# EAGLE design Chronio REV3 (EAGLE 7.7.0)
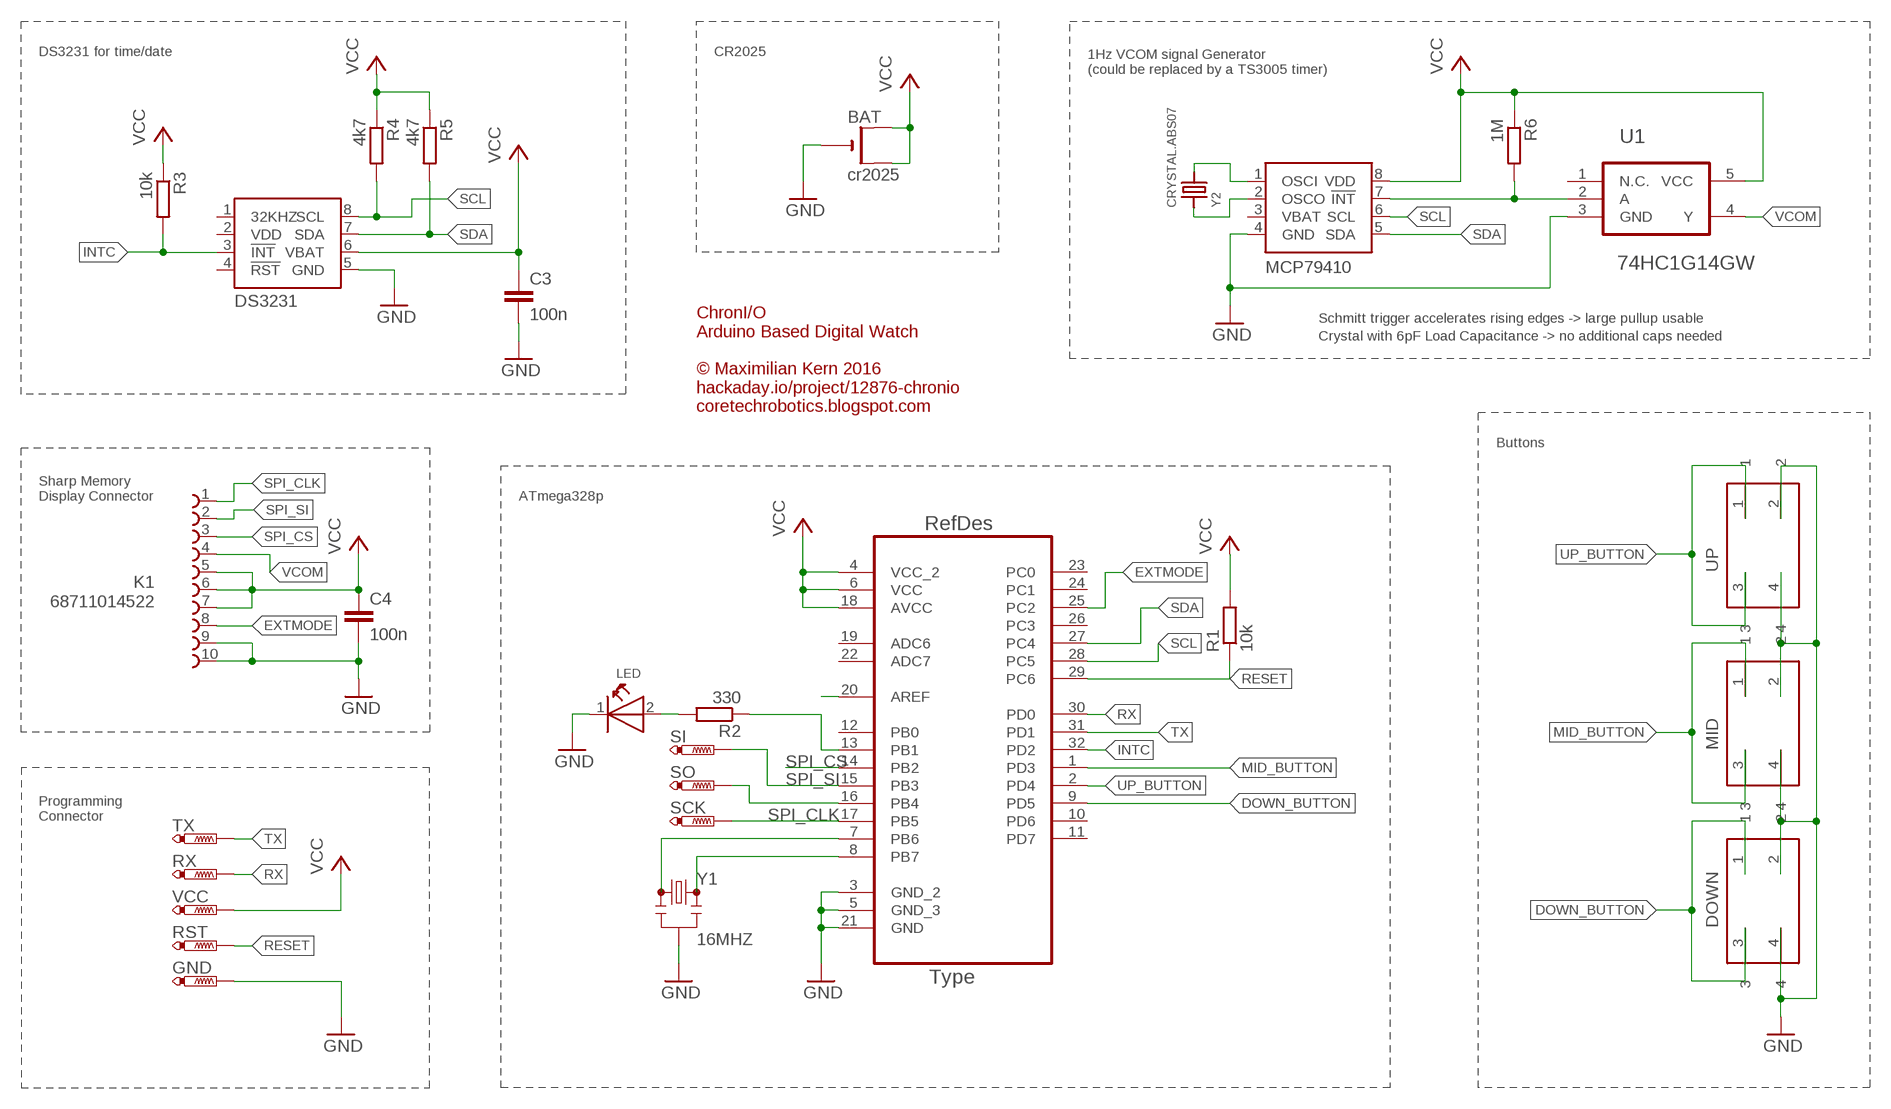
[diagram p0: schematic, sheet 1]

## Parts
ATMEGA328P  ATMEGA328P-AU  [QFP80P900X900X120-32N]
BAT  cr2025  CR2032SMT  [CR2032-SMD]
C3  100n  C-EUC0805  [C0805]
C4  100n  C-EUC0805  [C0805]
DOWN  434331045822  [434331045822]
DS3231  DS3231MLMD  [SO08]
GND  PTR1TP14SQ  [TP14SQ]
K1  68711014522  [68711014522]
LED  WL-SMCW-150060GS75000-G  [0603]
MCP79410  PCF8523T/1LMD  [SO08]
MID  434331045822  [434331045822]
R1  10k  R-EU_R0805  [R0805]
R2  330  R-EU_R0805  [R0805]
R3  10k  R-EU_R0805  [R0805]
R4  4k7  R-EU_R0805  [R0805]
R5  4k7  R-EU_R0805  [R0805]
R6  1M  R-EU_R0805  [R0805]
RST  PTR1TP14SQ  [TP14SQ]
RX  PTR1TP14SQ  [TP14SQ]
SCK  PTR1TP14SQ  [TP14SQ]
SI  PTR1TP14SQ  [TP14SQ]
SO  PTR1TP14SQ  [TP14SQ]
TX  PTR1TP14SQ  [TP14SQ]
U1  74HC1G14GW  [SOT65P210X110-5N]
UP  434331045822  [434331045822]
VCC  PTR1TP14SQ  [TP14SQ]
Y1  16MHZ  RESONATOR16MHZ  [RESONATOR-SMD]
Y2  CRYSTAL.ABS07  [ABS07]

## Nets
AREF: ATMEGA328P.20(AREF)
DOWN_BUTTON: ATMEGA328P.9(PD5) DOWN.1 DOWN.3
EXTMODE: ATMEGA328P.25(PC2) K1.8
GND: ATMEGA328P.3(GND_2) ATMEGA328P.5(GND_3) ATMEGA328P.21(GND) BAT.- C3.2 C4.2 DOWN.2 DOWN.4 DS3231.5(GND) GND.TP K1.9 K1.10 LED.1(K) MCP79410.4(GND) MID.2 MID.4 U1.3(GND) UP.2 UP.4 Y1.2
INTC: ATMEGA328P.32(PD2) DS3231.3(!INT) R3.2
MID_BUTTON: ATMEGA328P.1(PD3) MID.1 MID.3
N$1: ATMEGA328P.7(PB6) Y1.1
N$2: ATMEGA328P.8(PB7) Y1.3
N$3: MCP79410.7(!INT) R6.2 U1.2(A)
N$4: ATMEGA328P.16(PB4) SO.TP
N$5: MCP79410.1(OSCI) Y2.2
N$6: ATMEGA328P.13(PB1) R2.1
N$7: LED.2(A) R2.2
N$8: MCP79410.2(OSCO) Y2.1
RESET: ATMEGA328P.29(PC6) R1.1 RST.TP
RX: ATMEGA328P.30(PD0) RX.TP
SCL: ATMEGA328P.28(PC5) DS3231.8(SCL) MCP79410.6(SCL) R4.2
SDA: ATMEGA328P.27(PC4) DS3231.7(SDA) MCP79410.5(SDA) R5.2
SPI_CLK: ATMEGA328P.17(PB5) K1.1 SCK.TP
SPI_CS: ATMEGA328P.14(PB2) K1.3
SPI_SI: ATMEGA328P.15(PB3) K1.2 SI.TP
TX: ATMEGA328P.31(PD1) TX.TP
UP_BUTTON: ATMEGA328P.2(PD4) UP.1 UP.3
VCC: ATMEGA328P.4(VCC_2) ATMEGA328P.6(VCC) ATMEGA328P.18(AVCC) BAT.+$1(+) BAT.+$2(+1) C3.1 C4.1 DS3231.6(VBAT) K1.5 K1.6 K1.7 MCP79410.8(VDD) R1.2 R3.1 R4.1 R5.1 R6.1 U1.5(VCC) VCC.TP
VCOM: K1.4 U1.4(Y)
Unconnected: ATMEGA328P.10(PD6) ATMEGA328P.11(PD7) ATMEGA328P.12(PB0) ATMEGA328P.19(ADC6) ATMEGA328P.22(ADC7) ATMEGA328P.23(PC0) ATMEGA328P.24(PC1) ATMEGA328P.26(PC3) DS3231.1(32KHZ) DS3231.4(!RST) U1.1(N.C.)

## Notes on the sheet
- DS3231 for time/date | CR2025
- 1Hz VCOM signal Generator
  (could be replaced by a TS3005 timer)
- Schmitt trigger accelerates rising edges -> large pullup usable
- Crystal with 6pF Load Capacitance -> no additional caps needed
- ChronI/O
  Arduino Based Digital Watch
  
  © Maximilian Kern 2016
  hackaday.io/project/12876-chronio
  coretechrobotics.blogspot.com
- Buttons
- Sharp Memory
  Display Connector
- ATmega328p
- Programming
  Connector

## Power pins joined to a net without a drawn wire
VBAT: MCP79410.3(VBAT)
VDD: DS3231.2(VDD)

## Library data of the parts
ATMEGA328P = Atmel-ATMEGA328P-AU:ATMEGA328P-AU; DESCRIPTION: 8-bit Microcontroller with In-System Programmable Flash; MPN: ATMEGA328P-AU; OC_FARNELL: 1715486; OC_NEWARK: 14R4631; PACKAGE: TQFP-32; SUPPLIER: Atmel
BAT = adafruit:CR2032
C3 C4 = resistor:C-EU: CAPACITOR, European symbol
DOWN MID UP = Eagle_TACT_SWITCHES_rev16d:434331045822: 3.5x4.7 mm SMD side push WS-TASU <http://katalog.we-online.de/media/images/v2/Family_WS_TUS_Normal_SMD_Side-Push_4343x10458xx_pf2.jpg> Details see: http://katalog.we-online.de/en/em/TASU_3_5X4_7_SMD_J-BEND_SIDE_PUSH <http://katalog.we-online.de/en/em/TASU_3_5X4_7_SMD_SIDE_PUSH> 2015 (C) Wurth Elektronik
DS3231 = coreLib:DS3231M: Produktübersicht The DS3231MZ+TRL is a ±5ppm, I2C real time clock (RTC) in 8 pin NSOIC package. The low cost, extremely accurate, I2C RTC device incorporates a battery input and maintains accurate timekeeping when main power to the device is interrupted. The integration of microelectromechanical systems (MEMS) resonator enhances long-term accuracy of the device and reduces the piece part count in manufacturing line. The RTC maintains seconds, minutes, hours, day, date, month and year information. The date at the end of the month is automatically adjusted for months with fewer than 31 days including corrections for leap year. The clock operates in either the 24hour or 12hour format with an AM/PM indicator. A precision temperature compensated voltage reference and comparator circuit monitors the status of VCC to detect power failures to provide a reset output and to automatically switch to backup supply when necessary. The RST pin is monitored as a pushbutton input for generating a microprocessor reset. Supply voltage range is 2.3V to 5.5V Operating temperature range from -40°C to 85°C Leap year compensation up to year 2100 Footprint and functionally compatible to DS3231 Two programmable time of day alarms 1Hz and 32.768KHz outputs Digital temp sensor with ±3°C accuracy Address and data are transferred serially through an I2C bidirectional bus Low power operation extends battery backup run time UL recognized Technical Data Sheet (890.91KB) EN <http://www.farnell.com/datasheets/2001796.pdf>
GND RST RX SCK SI SO TX VCC = testpad:PTR1: TEST PIN
K1 = Eagle_FPC_CONNECTOR_AND_FFC_CAB_rev15c:68711014522: WR-FPC 0.5mm SMT ZIF Horizontal Bottom Contact, 10 Pins=>Code : Con_FPC_ZIF_0.50_68711014522 <http://katalog.we-online.de/media/images/eican/Con_FPC_ZIF_0.50_6871xx14522_pf2.jpg> Details see: http://katalog.we-online.de/en/em/687_1xx_145_22 Created 2014-07-09, Karrer Zheng 2014 (C) Würth Elektronik
LED = Eagle_COLOR_LED_rev15c:WL-SMCW: SMD mono-color Chip LED Characteristics Low energy consumption High reliability Low current requirement Fast switching No UV/IR radiation Smallest SMD package with exceptional brightness Top view Wide viewing angle PBC high-usage Applications Backlight for mobile and portable device keypads Indoor and outdoor message boards Flat backlight for LCDs, switches and symbols Display for industrial control systems and traffic Miniaturized color effects Pedestrian mark Optical indicators General lighting Toys <http://katalog.we-online.de/media/images/eipal/WL-SMCW_pf2.jpg> Details see: http://katalog.we-online.de/en/led/WL-SMCW?m Updated 2015-04-10 2015 (C) Wurth Elektronik; COMPANY-URL: http://www.we-online.de; CREATED-BY: Christin Otto; CREATED-DATE: APR 2013; DATASHEET-URL: http://katalog.we-online.de/en/led/WL-SMCW?m=t&sq=smcw&sp=&sp=http%3A%2F%2Fwww.we-online.de%2Fweb%2Fen%2Felectronic_components%2Fsearchpage_PBS.php%3Fsearch%3Dsmcw#vs_t2:2; MANUFACTURER: Würth Elektronik eiSos GmbH
MCP79410 = PCF8523:PCF8523T/1: Produktübersicht The PCF8523T/1,118 is a Real-Time Clock and calendar optimized for low power consumption. Data is transferred serially via the I²C-bus with a maximum data rate of 1000kbps. Alarm and timer functions are available with the possibility to generate a wake-up signal on an interrupt pin. An offset register allows fine-tuning of the clock. This has a backup battery switch-over circuit, which detects power failures and automatically switches to the battery supply when a power failure occurs. Battery backup input pin and switch-over circuit Freely programmable timer and alarm with interrupt capability Internal power-on reset Open-drain interrupt or clock output pins Programmable offset register for frequency adjustment Technical Data Sheet (631.73KB) EN <http://www.farnell.com/datasheets/1923815.pdf>
R1-R6 = resistor:R-EU_: RESISTOR, European symbol
U1 = 74HC1G14GW:74HC1G14GW: Inverter; MPN: 74HC1G14GW; OC_FARNELL: 1085254; OC_NEWARK: 03P2771; PACKAGE: SOT-5; SUPPLIER: NXP
Y1 = SparkFun-FreqCtrl:RESONATOR: Resonator Small SMD resonator. Used, eg, on the Arduino Pro/ Pro Mini boards. 8MHz- XTAL-08895 16MHz- XTAL-08900; PROD_ID: XTAL-08900
Y2 = abracon:CRYSTAL

## Net classes
0 default: width 0.152 mm, drill 0.508 mm, clearance 0.152 mm

## Board
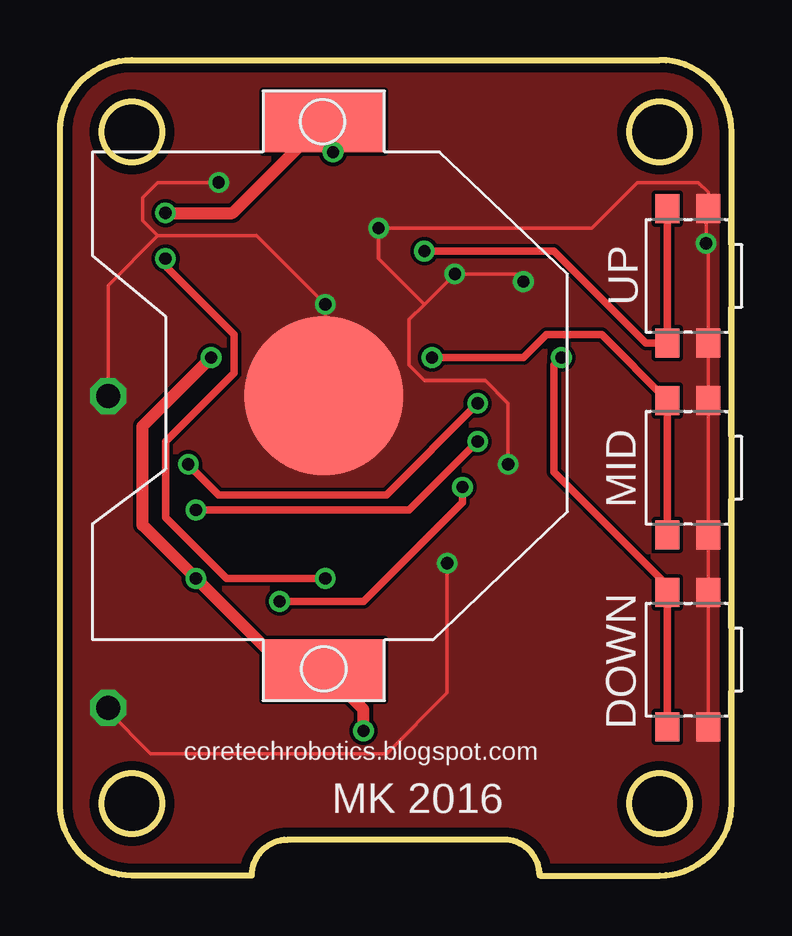
[diagram p1: board, top side]
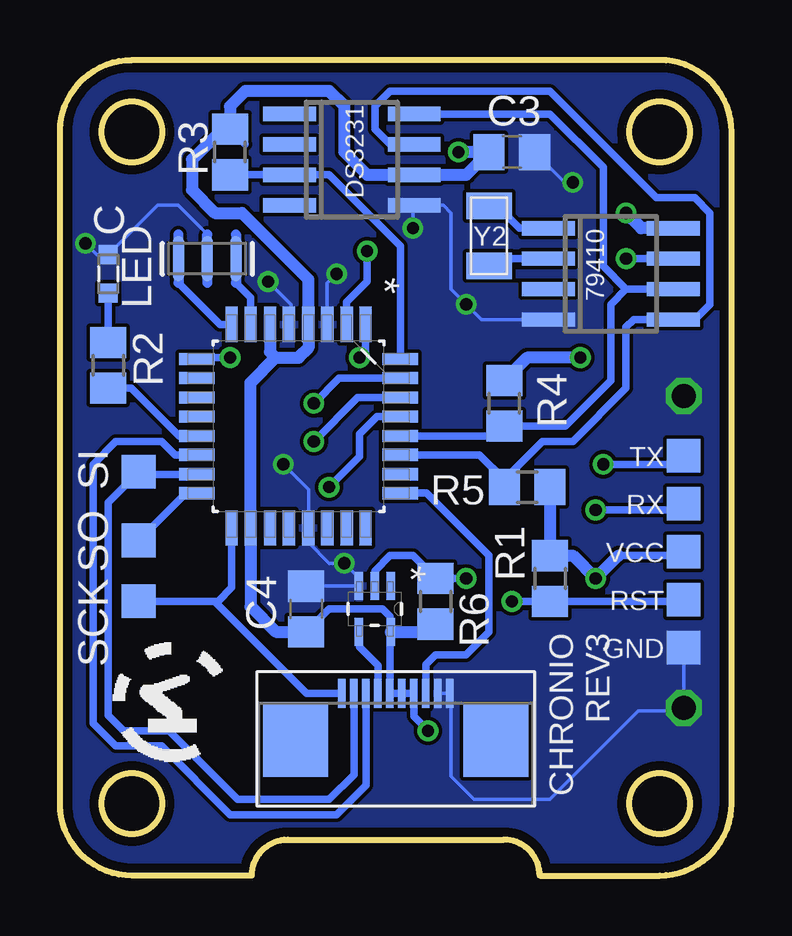
[diagram p2: board, bottom side, seen from below]

Size 28 x 34 mm. Coordinates in mm from the lower left corner, seen from the top.
Outline: 20,0 25,0 arc90 28,3 28,31 arc90 25,34 3,34 arc90 0,31 0,3 arc90 3,0 8,0 arc-90 9.5,1.5 18.5,1.5 arc-90 20,0
Outline: circle at 3,31 radius 1.25
Outline: circle at 25,31 radius 1.25
Outline: circle at 25,3 radius 1.25
Outline: circle at 3,3 radius 1.25
Copper layers (1*16): Top 0.0356mm / dielectric 1.5011mm / Bottom 0.0356mm
Design rules "LaenPCBOrder *": minimum track width 6mil, minimum drill 13mil, track to track 6mil, track to pad 6mil, pad to pad 6mil, via to via 6mil, smd to smd 0mil, copper to edge 15mil, drill to drill 6mil, minimum pad ring 7mil, minimum via ring 7mil, stop-mask expansion 3mil, vias tented up to drill 10mm, thermal gap 0mil

### Footprints (pad centres in the part's own frame; a part is rotated, then mirrored left to right if it is on the bottom)
QFP80P900X900X120-32N = smd 1.473 x 0.508: 1 -4.242,2.794; 2 -4.242,2.007; 3 -4.242,1.194; 4 -4.242,0.406; 5 -4.242,-0.406; 6 -4.242,-1.194; 7 -4.242,-2.007; 8 -4.242,-2.794; 17 4.242,-2.794; 18 4.242,-2.007; 19 4.242,-1.194; 20 4.242,-0.406; 21 4.242,0.406; 22 4.242,1.194; 23 4.242,2.007; 24 4.242,2.794 | smd 0.508 x 1.473: 9 -2.794,-4.242; 10 -2.007,-4.242; 11 -1.194,-4.242; 12 -0.406,-4.242; 13 0.406,-4.242; 14 1.194,-4.242; 15 2.007,-4.242; 16 2.794,-4.242; 25 2.794,4.242; 26 2.007,4.242; 27 1.194,4.242; 28 0.406,4.242; 29 -0.406,4.242; 30 -1.194,4.242; 31 -2.007,4.242; 32 -2.794,4.242
CR2032-SMD = smd 2.54 x 5.08: +$1 -11.43,0; +$2 11.43,0 | smd 6.604 x 6.604: - 0,0
C0805 = smd 1.3 x 1.5: 1 -0.95,0; 2 0.95,0
434331045822 = smd 1.2 x 1: 1 2.8,0.85; 2 2.8,-0.85; 3 -2.8,0.85; 4 -2.8,-0.85
SO08 = smd 0.6 x 2.2: 1 -1.905,-2.6; 2 -0.635,-2.6; 3 0.635,-2.6; 4 1.905,-2.6; 5 1.905,2.6; 6 0.635,2.6; 7 -0.635,2.6; 8 -1.905,2.6
TP14SQ = smd 1.4 x 1.4: TP 0,0
68711014522 = smd 0.3 x 1.2: 1 -2.25,0.6; 2 -1.75,0.6; 3 -1.25,0.6; 4 -0.75,0.6; 5 -0.25,0.6; 6 0.25,0.6; 7 0.75,0.6; 8 1.25,0.6; 9 1.75,0.6; 10 2.25,0.6 | smd 2.7 x 3: Z1 -4.18,-1.38; Z2 4.18,-1.38
0603 = smd 0.8 x 0.8: 1 -0.8,0; 2 0.8,0
R0805 = smd 1.3 x 1.5: 1 -0.95,0; 2 0.95,0
SOT65P210X110-5N = smd 1.168 x 0.356: 1 -0.965,0.66; 2 -0.965,0; 3 -0.965,-0.66; 4 0.965,-0.66; 5 0.965,0.66
RESONATOR-SMD = smd 0.45 x 1.905: 1 -1.2,0; 2 0,0; 3 1.2,0
ABS07 = smd 1.1 x 1.9: 1 -1.25,0; 2 1.25,0

### Placement (x,y rotation side)
ATMEGA328P  18.05,18.73 270 bottom
BAT  11,20 90 top
C3  9.16,30.16 0 bottom
C4  17.73,11.11 90 bottom
DOWN  26.18,9 90 top
DS3231  15.83,29.84 270 bottom
GND  2,9.5 270 bottom
K1  14,7 0 bottom
LED  25.99,25.08 270 bottom
MCP79410  5.03,25.08 270 bottom
MID  26.18,17 90 top
R1  7.57,12.38 90 bottom
R2  25.99,21.27 90 bottom
R3  20.91,30.16 270 bottom
R4  9.48,19.68 270 bottom
R5  8.53,16.19 180 bottom
R6  12.34,11.43 90 bottom
RST  2,11.5 270 bottom
RX  2,15.5 270 bottom
SCK  24.72,11.43 180 bottom
SI  24.72,16.83 180 bottom
SO  24.72,13.97 180 bottom
TX  2,17.5 270 bottom
U1  14.88,11.11 270 bottom
UP  26.18,25 90 top
VCC  2,13.5 270 bottom
Y1  21.86,25.72 180 bottom
Y2  10.11,26.67 90 bottom

### Tracks (layer width: path | path; a pad name or v marks a point on that pad's centre or on a via)
DOWN_BUTTON  (via drill 0.51 pad 0.51)
  Top 0.305: DOWN.3 DOWN.1 25.62,11.8 20.59,16.83 20.59,21.27 v20.91,21.59
  Bottom 0.305: v20.91,21.59 22.23,21.59 ATMEGA328P.9
EXTMODE
  Bottom 0.305: ATMEGA328P.25 12.72,15.94 10.11,13.34 10.11,10.16 11.06,9.21 12.34,9.21 12.75,8.79 K1.8
GND  (via drill 0.51 pad 0.51, 1 pad 0.51)
  Top 0.152: v16.14,13.02 16.14,7.62 13.61,5.08 3.79,5.08 2,6.87 v2,7 | 4.08,26.67 2,24.59 v2,20 | 4.08,26.67 8.21,26.67 v11.06,23.81 11.06,20.07 BAT.- | DOWN.4 DOWN.2 MID.4 MID.2 UP.4 27.03,26.26 v26.94,26.35 26.94,27.71 UP.2 27.03,28.48 26.62,28.89 24.08,28.89 22.18,26.99 v13.29,26.99 13.29,25.72 15.19,23.81 | v6.62,28.89 4.08,28.89 3.45,28.26 3.45,27.3 4.08,26.67 | v18.68,17.14 18.68,19.68 17.73,20.64 15.19,20.64 14.56,21.27 14.56,23.18 15.19,23.81 | v19.32,24.77 19,25.08 v16.46,25.08 15.19,23.81
  Bottom 0.152: K1.9 K1.10 11.7,7.55 11.7,4.13 10.75,3.17 7.57,3.17 3.88,6.87 2.13,6.87 v2,7 GND.TP | C4.2 17.72,12.08 U1.3 15.54,12.41 v16.14,13.02 16.78,13.02 17.64,13.88 ATMEGA328P.21 17.64,16.1 v18.68,17.14 | v6.62,28.89 6.94,28.89 C3.2 | MCP79410.4 10.43,23.18 v11.06,23.81 11.7,24.45 11.7,27.62 12.02,27.94 DS3231.5 13.29,27.88 v13.29,26.99 | ATMEGA328P.3 16.86,24.69 v16.46,25.08 | ATMEGA328P.5 18.37,23.06 18.37,23.81 v19.32,24.77 | v26.94,26.35 26.47,25.88 LED.1 23.93,27.94 23.07,27.94 21.86,26.73
  pour Bottom: -1,35 29,35 29,-1 -1,-1
  pour Top: -1,35 29,35 29,-1 -1,-1
INTC
  Bottom 0.305: ATMEGA328P.32 13.81,26.24 16.78,29.21 DS3231.3 R3.2
MID_BUTTON  (via drill 0.51 pad 0.51)
  Top 0.305: MID.3 MID.1 22.59,22.54 20.27,22.54 19.32,21.59 v15.51,21.59
  Bottom 0.305: ATMEGA328P.1 15.26,21.84 v15.51,21.59
N$1
  Bottom 0.305: ATMEGA328P.7 20.06,24.1 20.66,24.7
N$2
  Bottom 0.305: ATMEGA328P.8 21.33,22.97 23.06,24.7
N$3  (via drill 0.51 pad 0.51)
  Top 0.305: v4.4,25.72 4.4,25.4 7.26,22.54 7.26,20.95 4.4,18.1 4.4,14.92 6.94,12.38 v11.06,12.38
  Bottom 0.305: U1.2 14.88,12.7 14.24,13.34 13.29,13.34 R6.2 v11.06,12.38 | MCP79410.7 v4.4,25.72
N$4
  Bottom 0.305: ATMEGA328P.16 22.75,15.94 SO.TP
N$5
  Bottom 0.305: MCP79410.1 8.84,26.99 9.48,27.62 9.81,27.62 Y2.2
N$6
  Bottom 0.305: ATMEGA328P.13 23.04,18.33 25.04,20.32 R2.1
N$7
  Bottom 0.305: R2.2 LED.2
N$8
  Bottom 0.305: MCP79410.2 9.81,25.72 Y2.1
RESET  (via drill 0.51 pad 0.51)
  Top 0.305: v16.78,16.19 16.78,15.56 12.65,11.43 v9.16,11.43
  Bottom 0.305: ATMEGA328P.29 14.79,19.14 15.51,18.41 15.51,17.46 v16.78,16.19 | v9.16,11.43 R1.1 | R1.1 | R1.1 2.07,11.43 RST.TP
RX  (via drill 0.51 pad 0.64)
  Top 0.305: v17.41,18.1 14.56,15.24 v5.67,15.24
  Bottom 0.305: ATMEGA328P.30 15.59,19.93 v17.41,18.1 | v5.67,15.24 2.26,15.24 RX.TP
SCL
  Bottom 0.305: MCP79410.6 4.4,24.45 | 4.4,24.45 5.35,25.4 5.35,29.53 7.57,31.75 DS3231.8 | ATMEGA328P.28 9.89,18.33 R4.2 6.93,18.73 5.03,20.64 5.03,23.81 4.4,24.45
SDA
  Bottom 0.305: ATMEGA328P.27 10.5,17.54 9.48,16.51 9.47,16.51 | DS3231.7 14.24,30.48 14.88,31.11 14.88,32.07 14.24,32.7 7.57,32.7 3.13,28.26 1.54,28.26 0.91,27.62 0.91,23.81 1.54,23.18 MCP79410.5 4.08,23.18 4.4,22.86 4.4,20.32 6.62,18.1 7.89,18.1 9.47,16.51 | R5.2 9.47,16.51
SPI_CLK
  Bottom 0.305: ATMEGA328P.17 20.84,12 21.42,11.43 21.54,11.43 | SCK.TP 21.54,11.43 | K1.1 17.71,7.6 21.54,11.43
SPI_CS
  Bottom 0.305: K1.3 15.25,3.75 16.46,2.54 20.91,2.54 23.77,5.4 25.67,5.4 26.62,6.35 26.62,17.14 25.67,18.1 23.77,18.1 23.21,17.54 ATMEGA328P.14
SPI_SI
  Bottom 0.305: K1.2 15.75,4.21 16.78,3.17 20.59,3.17 23.45,6.03 25.35,6.03 25.99,6.67 25.99,15.56 SI.TP 24.62,16.73 ATMEGA328P.15
TX  (via drill 0.51 pad 0.64)
  Top 0.305: v17.41,19.68 13.61,15.88 6.62,15.88 v5.35,17.14
  Bottom 0.305: ATMEGA328P.31 16.36,20.74 v17.41,19.68 | v5.35,17.14 2.35,17.14 TX.TP
UP_BUTTON  (via drill 0.51 pad 0.51)
  Top 0.305: UP.1 UP.3 24.43,22.2 20.59,26.04 v15.19,26.04
  Bottom 0.305: ATMEGA328P.2 16.04,23.91 15.19,24.77 v15.19,26.04
VCC  (via drill 0.51 pad 0.51, 0.51 pad 0.64)
  Top 0.305: BAT.+$2 11.38,31.05 | BAT.+$1 9.19,8.57
  Top 0.508: 9.79,31.43 BAT.+$2 | v11.38,30.16 11.38,31.05 | v12.65,6.03 12.65,6.92 BAT.+$1 9.48,8.57 v5.67,12.38 3.45,14.61 3.45,18.73 v6.3,21.59 | v4.4,27.62 7.19,27.62 BAT.+$2
  Bottom 0.305: 12.67,10.15 R6.1 | C4.1 16.78,11.11 14.56,11.11 14.24,10.79 14.24,10.17 U1.5 14.25,10.11 K1.5 K1.6 K1.7 13.25,6.63 v12.65,6.03 | 21.23,31.11 R3.1 20.27,30.48 | 4.71,13.34 2.17,13.34 VCC.TP
  Bottom 0.508: U1.5 12.67,10.15 | ATMEGA328P.6 19.24,21.83 19,21.59 | 19,21.59 18.05,21.59 17.64,22 ATMEGA328P.4 17.64,24.85 20.41,27.62 21.54,27.62 22.5,28.57 22.5,29.84 21.23,31.11 | 19,21.59 20.06,20.54 ATMEGA328P.18 20.06,11.21 19,10.16 C4.1 | v11.38,30.16 C3.1 11.06,29.21 DS3231.6 15.19,29.21 16.14,30.16 16.14,32.07 16.78,32.7 20.27,32.7 20.91,32.07 R3.1 | v6.3,21.59 8.52,21.59 R4.1 | R5.1 R1.2 6.62,13.34 v5.67,12.38 4.71,13.34 | MCP79410.8 3.76,26.99 v4.4,27.62
VCOM
  Bottom 0.305: K1.4 14.75,8.77 15.51,9.53 15.51,10.12 U1.4

### Text on the board
tNames: coretechrobotics.blogspot.com | MK 2016
bNames: DS3231 | 79410 | CHRONIO / REV3